# Altium project Dionysus LCD PMOD Rev B.PrjPCB
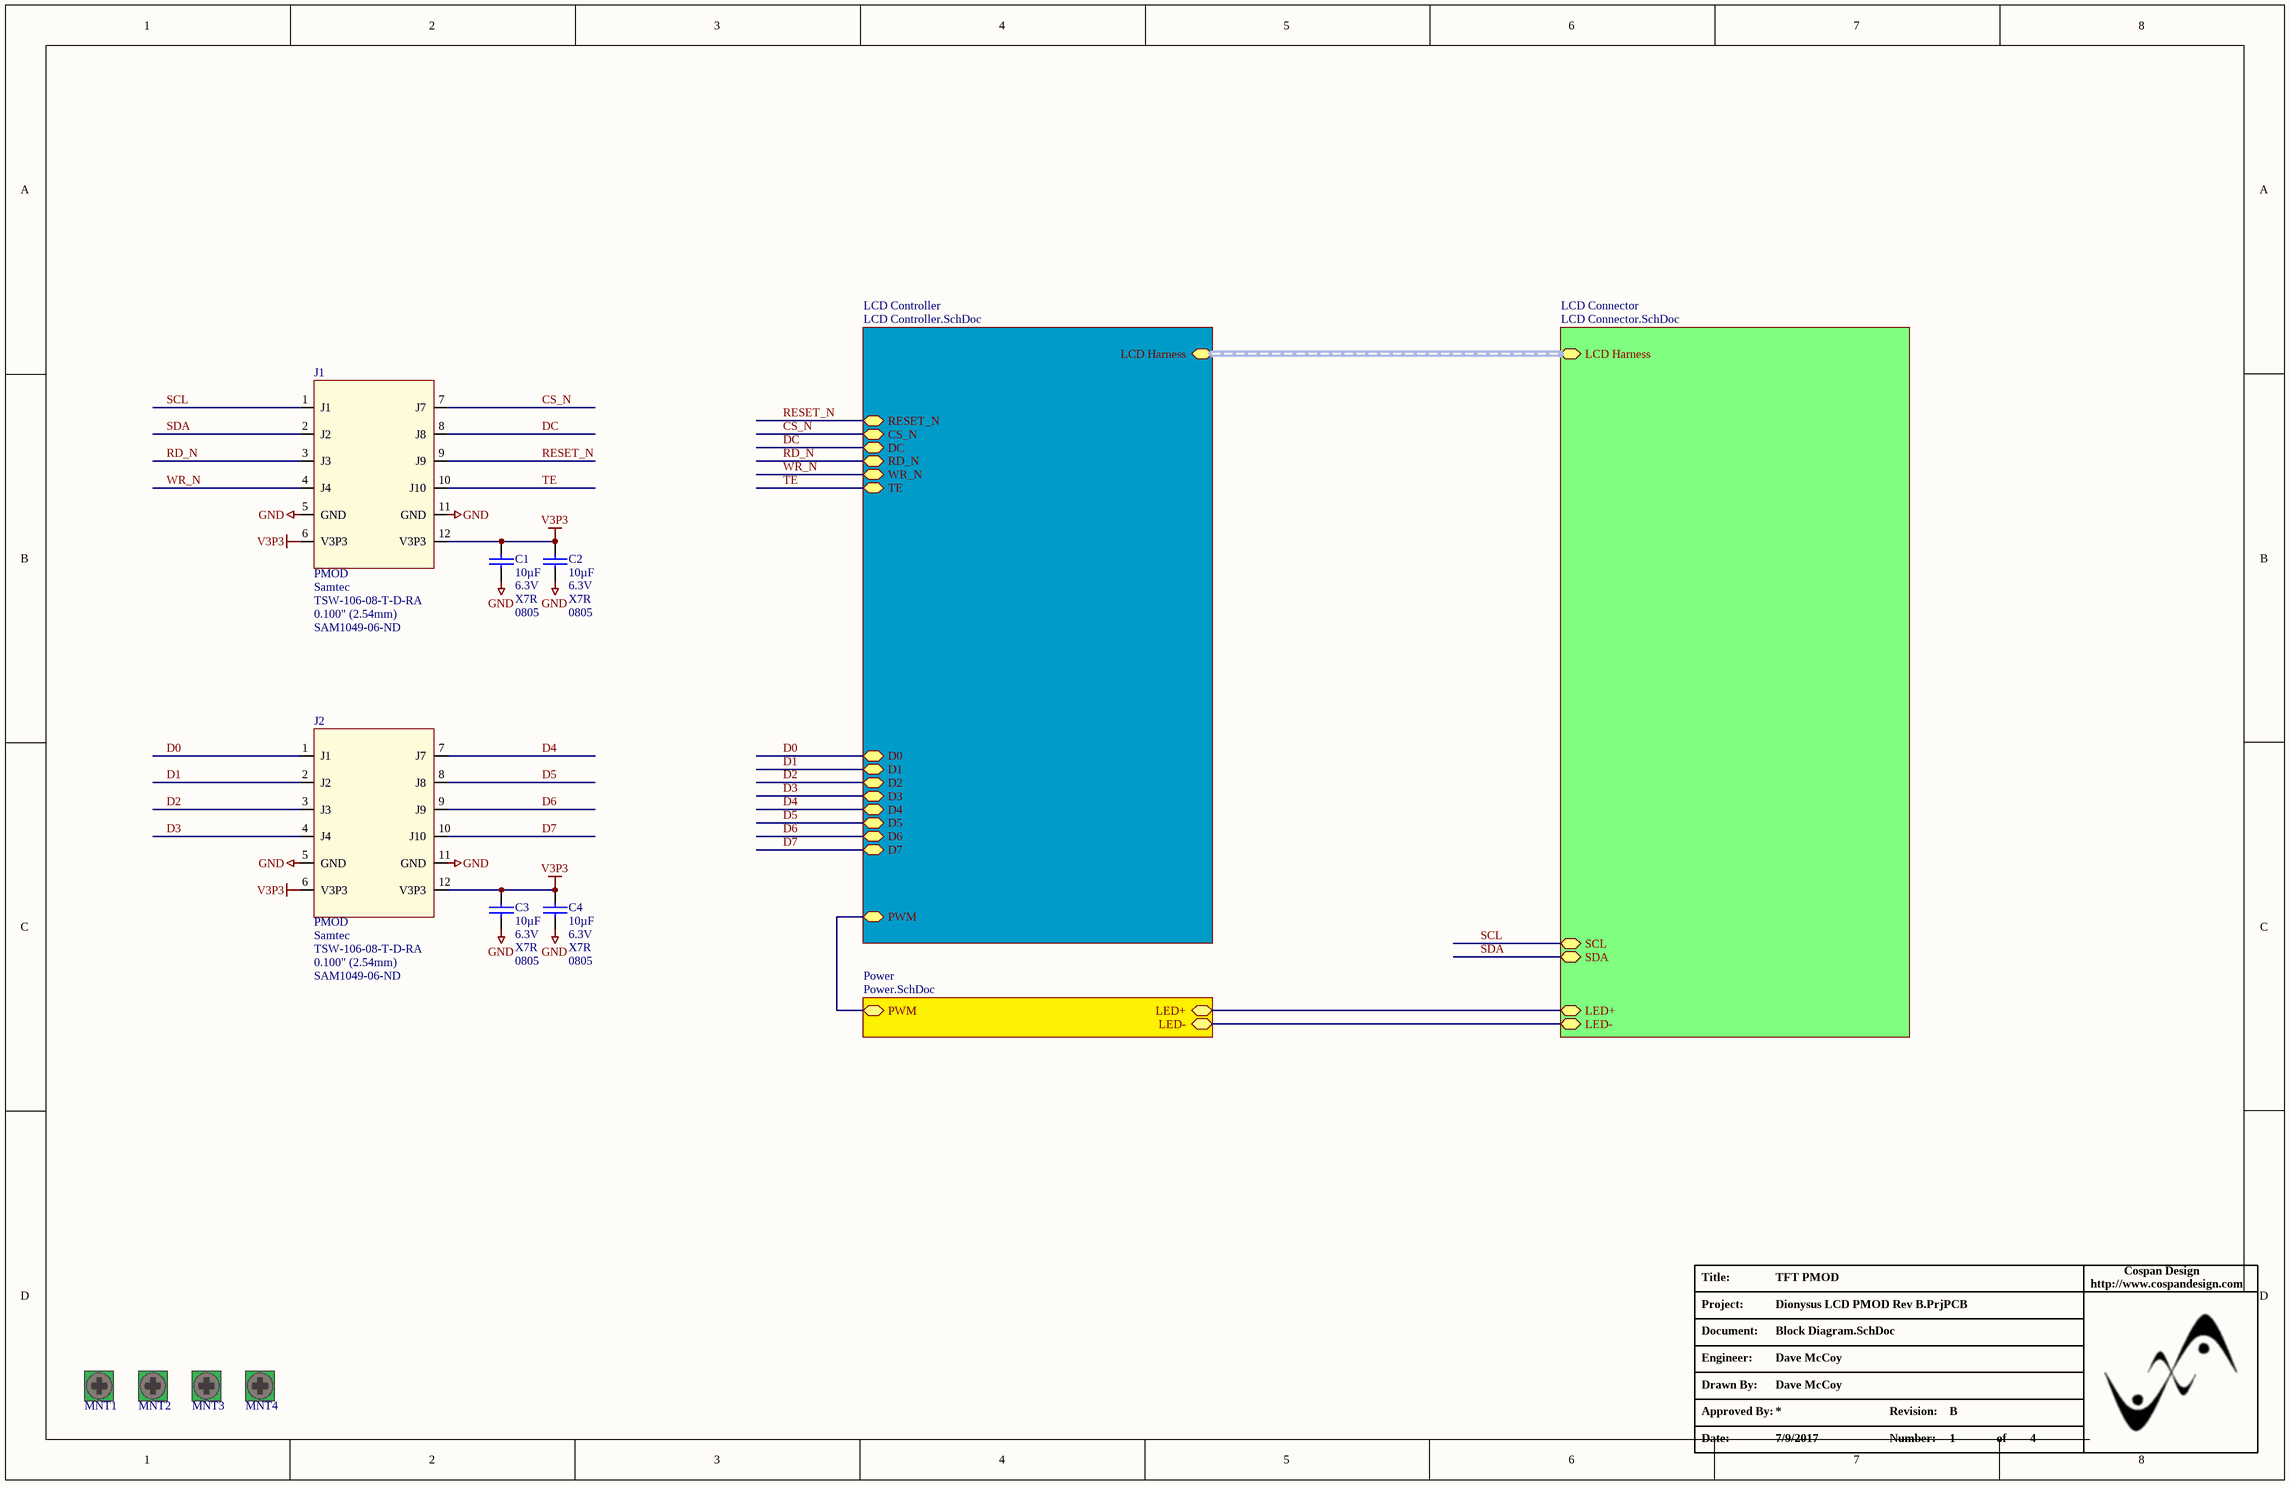
[diagram p0: Block Diagram.SchDoc]
Revision: B
4 sheets, 65 parts. Net scope: hierarchical (ports join the sheet entries above them; power ports are global).
Board file: Dionysus LCD PMOD.PcbDoc
Sheets:
  Block Diagram.SchDoc
    LCD Controller = LCD Controller.SchDoc
    LCD Connector = LCD Connector.SchDoc
    Power = Power.SchDoc

## Sheet Block Diagram.SchDoc: TFT PMOD
size Tabloid; Date: 7/9/2017; DrawnBy: Dave McCoy; Engineer: Dave McCoy; DocumentNumber: 1; Revision: B; SheetNumber: 1; SheetTotal: 4

### Parts
C1  Capacitance: 10µF  Voltage - Rated: 6.3V  Temperature Coefficient: X7R  Package / Case: 0805  [C_ERA-0805]  (hidden comment: 10uF)
C2  Capacitance: 10µF  Voltage - Rated: 6.3V  Temperature Coefficient: X7R  Package / Case: 0805  [C_ERA-0805]  (hidden comment: 10uF)
C3  Capacitance: 10µF  Voltage - Rated: 6.3V  Temperature Coefficient: X7R  Package / Case: 0805  [C_ERA-0805]  (hidden comment: 10uF)
C4  Capacitance: 10µF  Voltage - Rated: 6.3V  Temperature Coefficient: X7R  Package / Case: 0805  [C_ERA-0805]  (hidden comment: 10uF)
J1  PMOD  Manufacturer: Samtec  Manufacturer Part Number: TSW-106-08-T-D-RA  Pitch: 0.100" (2.54mm)  Supplier Part Number 1: SAM1049-06-ND  [PMOD PERIPHERAL]
J2  PMOD  Manufacturer: Samtec  Manufacturer Part Number: TSW-106-08-T-D-RA  Pitch: 0.100" (2.54mm)  Supplier Part Number 1: SAM1049-06-ND  [PMOD PERIPHERAL]
MNT1  Mounting Hole  [MNT_4-40]  (value not drawn)  (no BOM)
MNT2  Mounting Hole  [MNT_4-40]  (value not drawn)  (no BOM)
MNT3  Mounting Hole  [MNT_4-40]  (value not drawn)  (no BOM)
MNT4  Mounting Hole  [MNT_4-40]  (value not drawn)  (no BOM)

### Sub-sheets
LCD Connector = LCD Connector.SchDoc: LCD Harness (harness LCD Harness), LED+, LED-, SCL, SDA
LCD Controller = LCD Controller.SchDoc: PWM, LCD Harness (harness LCD Harness), RESET_N, CS_N, DC, RD_N, WR_N, TE, D0, D1, D2, D3, D4, D5, D6, D7
Power = Power.SchDoc: PWM, LED+, LED-

### Nets
GND: C1.1 C2.1 C3.1 C4.1 J1.5(GND) J1.11(GND) J2.5(GND) J2.11(GND)
V3P3: C1.2 C2.2 C3.2 C4.2 J1.6(V3P3) J1.12(V3P3) J2.6(V3P3) J2.12(V3P3)
CS_N: J1.7(J7) ; sheet LCD Controller/CS_N
D0: J2.1(J1) ; sheet LCD Controller/D0
D1: J2.2(J2) ; sheet LCD Controller/D1
D2: J2.3(J3) ; sheet LCD Controller/D2
D3: J2.4(J4) ; sheet LCD Controller/D3
D4: J2.7(J7) ; sheet LCD Controller/D4
D5: J2.8(J8) ; sheet LCD Controller/D5
D6: J2.9(J9) ; sheet LCD Controller/D6
D7: J2.10(J10) ; sheet LCD Controller/D7
DC: J1.8(J8) ; sheet LCD Controller/DC
LED+: sheet LCD Connector/LED+, sheet Power/LED+
LED-: sheet LCD Connector/LED-, sheet Power/LED-
PWM: sheet LCD Controller/PWM, sheet Power/PWM
RD_N: J1.3(J3) ; sheet LCD Controller/RD_N
RESET_N: J1.9(J9) ; sheet LCD Controller/RESET_N
SCL: J1.1(J1) ; sheet LCD Connector/SCL
SDA: J1.2(J2) ; sheet LCD Connector/SDA
TE: J1.10(J10) ; sheet LCD Controller/TE
WR_N: J1.4(J4) ; sheet LCD Controller/WR_N

### Buses and harness runs
harness sheet LCD Connector/LCD Harness = sheet LCD Controller/LCD Harness

### Notes on the sheet
- Title:
- http://www.cospandesign.com
- Cospan Design
- Project:
- Document:
- Engineer:
- Drawn By:
- Approved By:
- Revision:
- Date:
- Number:
- of

### Library data of the parts
C1-C4 = C_0805_10UF_6.3V: CAP CER 10UF 6.3V X7R 10% 0805; Manufacturer: Taiyo Yuden; Manufacturer Part Number: JMK212BJ106KD-T; Supplier 1: Digi-Key; RoHS: RoHS Compliant; Category: Capacitors; Stock 1: 94004; Pricing 1: 1=0.19, 10=0.132, 50=0.08, 100=0.0672, 250=0.0544, 500=0.048, 1000=0.0408 (USD); Tolerance: ±10%; Mounting Type: Surface Mount, MLCC; Operating Temperature: -55°C ~ 85°C; Applications: General Purpose; Ratings: -; Size / Dimension: 0.079" L x 0.049" W (2.00mm x 1.25mm); Height - Seated (Max): -; Thickness (Max): 0.037" (0.95mm); Lead Spacing: -; Features: -; Packaging: Cut Tape (CT); Lead Style: -; ComponentLink1URL: http://www.yuden.co.jp/productdata/catalog/en/mlcc01_e.pdf; ComponentLink1Description: http://www.yuden.co.jp/productdata/catalog/en/mlcc01_e.pdf; Supplier Part Number 1: 587-1304-1-ND; COST_1: *; COST_100: *; COST_1000: *; MANF1: *; MANF1_PN: *; MANF2: *; MANF2_PN: *; MANF3: *; MANF3_PN: *; VENDOR1: *; VENDOR1_PN: *
J1 J2 = J_PMOD_PERIPH: CONN HEADER 12PS .100 DL R/A TIN; Connector Type: Header, Unshrouded; Number of Positions: 12; Number of Positions Loaded: All; Supplier 1: Digi-Key; RoHS: RoHS Compliant; Category: Connectors, Interconnects; Stock 1: 0; Pricing 1: 1=1.4, 10=1.252, 100=1.0309, 500=0.81492, 1000=0.69955, 5000=0.63818, 10000=0.61364 (USD); Packaging: Bulk; Contact Type: Male Pin; Number of Rows: 2; Row Spacing: 0.100" (2.54mm); Contact Mating Length: 0.230" (5.84mm); Mounting Type: Through Hole, Right Angle; Termination: Solder; Fastening Type: -; Features: -; Contact Finish: Tin; Contact Finish Thickness: -; Color: Black; ComponentLink1URL: http://www.samtec.com/documents/webfiles/cpdf/TSW-XXX-XX-XXX-X-XX-XXX-MKT.pdf; ComponentLink1Description: http://www.samtec.com/documents/webfiles/cpdf/TSW-XXX-XX-XXX-X-XX-XXX-MKT.pdf
MNT1-MNT4 = MNT_440_HOLE

## Sheet LCD Controller.SchDoc: TFT PMOD
size Tabloid; Date: 7/9/2017; DrawnBy: Dave McCoy; Engineer: Dave McCoy; DocumentNumber: 2; Revision: B; SheetNumber: 2; SheetTotal: 4
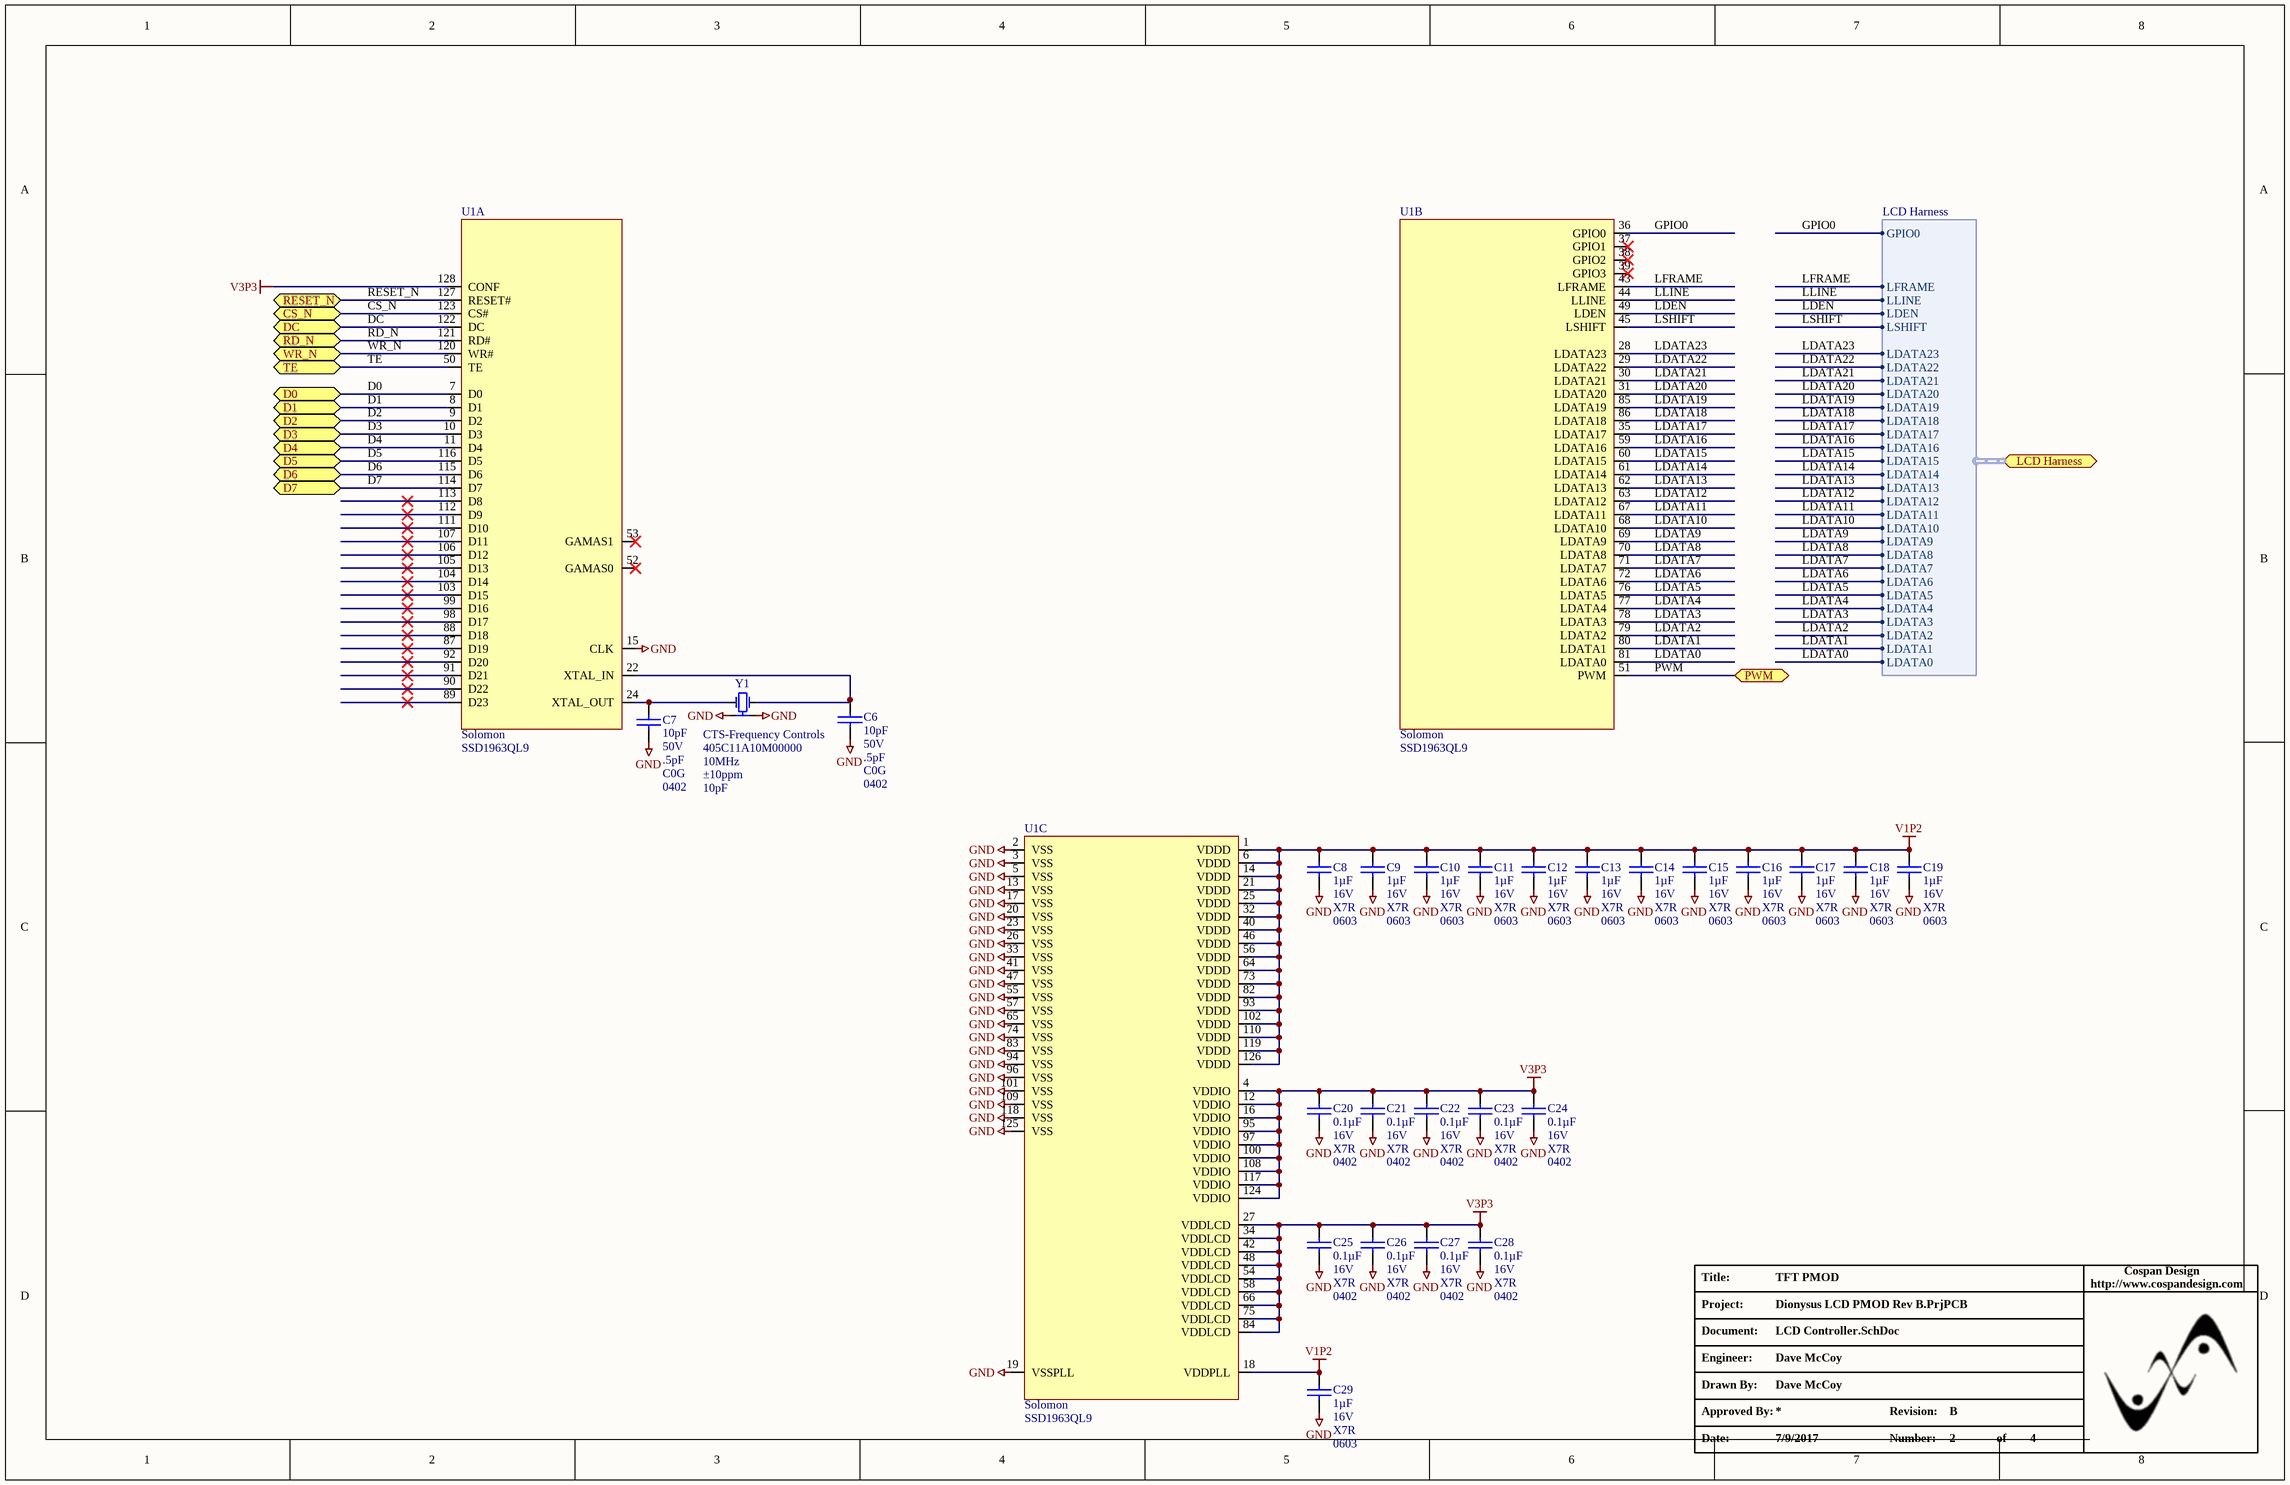
[diagram p1: LCD Controller.SchDoc]

### Parts
C6  Voltage - Rated: 50V  Tolerance: .5pF  Temperature Coefficient: C0G  Package / Case: 0402  [C_ERA-0402]  (hidden comment: 10pF)
C7  Voltage - Rated: 50V  Tolerance: .5pF  Temperature Coefficient: C0G  Package / Case: 0402  [C_ERA-0402]  (hidden comment: 10pF)
C8  Capacitance: 1µF  Voltage - Rated: 16V  Temperature Coefficient: X7R  Package / Case: 0603  [C_ERA-0603]  (hidden comment: C_0603_1µF_16V)
C9  Capacitance: 1µF  Voltage - Rated: 16V  Temperature Coefficient: X7R  Package / Case: 0603  [C_ERA-0603]  (hidden comment: C_0603_1µF_16V)
C10  Capacitance: 1µF  Voltage - Rated: 16V  Temperature Coefficient: X7R  Package / Case: 0603  [C_ERA-0603]  (hidden comment: C_0603_1µF_16V)
C11  Capacitance: 1µF  Voltage - Rated: 16V  Temperature Coefficient: X7R  Package / Case: 0603  [C_ERA-0603]  (hidden comment: C_0603_1µF_16V)
C12  Capacitance: 1µF  Voltage - Rated: 16V  Temperature Coefficient: X7R  Package / Case: 0603  [C_ERA-0603]  (hidden comment: C_0603_1µF_16V)
C13  Capacitance: 1µF  Voltage - Rated: 16V  Temperature Coefficient: X7R  Package / Case: 0603  [C_ERA-0603]  (hidden comment: C_0603_1µF_16V)
C14  Capacitance: 1µF  Voltage - Rated: 16V  Temperature Coefficient: X7R  Package / Case: 0603  [C_ERA-0603]  (hidden comment: C_0603_1µF_16V)
C15  Capacitance: 1µF  Voltage - Rated: 16V  Temperature Coefficient: X7R  Package / Case: 0603  [C_ERA-0603]  (hidden comment: C_0603_1µF_16V)
C16  Capacitance: 1µF  Voltage - Rated: 16V  Temperature Coefficient: X7R  Package / Case: 0603  [C_ERA-0603]  (hidden comment: C_0603_1µF_16V)
C17  Capacitance: 1µF  Voltage - Rated: 16V  Temperature Coefficient: X7R  Package / Case: 0603  [C_ERA-0603]  (hidden comment: C_0603_1µF_16V)
C18  Capacitance: 1µF  Voltage - Rated: 16V  Temperature Coefficient: X7R  Package / Case: 0603  [C_ERA-0603]  (hidden comment: C_0603_1µF_16V)
C19  Capacitance: 1µF  Voltage - Rated: 16V  Temperature Coefficient: X7R  Package / Case: 0603  [C_ERA-0603]  (hidden comment: C_0603_1µF_16V)
C20  Capacitance: 0.1µF  Voltage - Rated: 16V  Temperature Coefficient: X7R  Package / Case: 0402  [C_0402]  (hidden comment: 0.1uF)
C21  Capacitance: 0.1µF  Voltage - Rated: 16V  Temperature Coefficient: X7R  Package / Case: 0402  [C_0402]  (hidden comment: 0.1uF)
C22  Capacitance: 0.1µF  Voltage - Rated: 16V  Temperature Coefficient: X7R  Package / Case: 0402  [C_0402]  (hidden comment: 0.1uF)
C23  Capacitance: 0.1µF  Voltage - Rated: 16V  Temperature Coefficient: X7R  Package / Case: 0402  [C_0402]  (hidden comment: 0.1uF)
C24  Capacitance: 0.1µF  Voltage - Rated: 16V  Temperature Coefficient: X7R  Package / Case: 0402  [C_0402]  (hidden comment: 0.1uF)
C25  Capacitance: 0.1µF  Voltage - Rated: 16V  Temperature Coefficient: X7R  Package / Case: 0402  [C_0402]  (hidden comment: 0.1uF)
C26  Capacitance: 0.1µF  Voltage - Rated: 16V  Temperature Coefficient: X7R  Package / Case: 0402  [C_0402]  (hidden comment: 0.1uF)
C27  Capacitance: 0.1µF  Voltage - Rated: 16V  Temperature Coefficient: X7R  Package / Case: 0402  [C_0402]  (hidden comment: 0.1uF)
C28  Capacitance: 0.1µF  Voltage - Rated: 16V  Temperature Coefficient: X7R  Package / Case: 0402  [C_0402]  (hidden comment: 0.1uF)
C29  Capacitance: 1µF  Voltage - Rated: 16V  Temperature Coefficient: X7R  Package / Case: 0603  [C_ERA-0603]  (hidden comment: C_0603_1µF_16V)
U1  Manufacturer: Solomon  [LQFP128]  (hidden comment: U_SSD1963QL9)  (parts A,B,C of 3)
Y1  Manufacturer: CTS-Frequency Controls  Manufacturer Part Number: 405C11A10M00000  Frequency: 10MHz  Frequency Stability: ±10ppm  Load Capacitance: 10pF  [SMD_OSC_8MHZ]  (hidden comment: Y_SMD_10.00MHZ_10PF)

### Ports
CS_N, D0, D1, D2, D3, D4, D5, D6, D7, DC, LCD Harness (harness LCD Harness), PWM, RD_N, RESET_N, TE, WR_N

### Harnesses
LCD Harness: GPIO0, LFRAME, LLINE, LDEN, LSHIFT, LDATA0, LDATA1, LDATA2, LDATA3, LDATA4, LDATA5, LDATA6, LDATA7, LDATA8, LDATA9, LDATA10, LDATA11, LDATA12, LDATA13, LDATA14, LDATA15, LDATA16, LDATA17, LDATA18, LDATA19, LDATA20, LDATA21, LDATA22, LDATA23

### Nets
GND: C6.1 C7.1 C8.1 C9.1 C10.1 C11.1 C12.1 C13.1 C14.1 C15.1 C16.1 C17.1 C18.1 C19.1 C20.1 C21.1 C22.1 C23.1 C24.1 C25.1 C26.1 C27.1 C28.1 C29.1 U1.2(VSS) U1.3(VSS) U1.5(VSS) U1.13(VSS) U1.15(CLK) U1.17(VSS) U1.19(VSSPLL) U1.20(VSS) U1.23(VSS) U1.26(VSS) U1.33(VSS) U1.41(VSS) U1.47(VSS) U1.55(VSS) U1.57(VSS) U1.65(VSS) U1.74(VSS) U1.83(VSS) U1.94(VSS) U1.96(VSS) U1.101(VSS) U1.109(VSS) U1.118(VSS) U1.125(VSS) Y1.2 Y1.4
V1P2: C8.2 C9.2 C10.2 C11.2 C12.2 C13.2 C14.2 C15.2 C16.2 C17.2 C18.2 C19.2 C29.2 U1.1(VDDD) U1.6(VDDD) U1.14(VDDD) U1.18(VDDPLL) U1.21(VDDD) U1.25(VDDD) U1.32(VDDD) U1.40(VDDD) U1.46(VDDD) U1.56(VDDD) U1.64(VDDD) U1.73(VDDD) U1.82(VDDD) U1.93(VDDD) U1.102(VDDD) U1.110(VDDD) U1.119(VDDD) U1.126(VDDD)
V3P3: C20.2 C21.2 C22.2 C23.2 C24.2 C25.2 C26.2 C27.2 C28.2 U1.4(VDDIO) U1.12(VDDIO) U1.16(VDDIO) U1.27(VDDLCD) U1.34(VDDLCD) U1.42(VDDLCD) U1.48(VDDLCD) U1.54(VDDLCD) U1.58(VDDLCD) U1.66(VDDLCD) U1.75(VDDLCD) U1.84(VDDLCD) U1.95(VDDIO) U1.97(VDDIO) U1.100(VDDIO) U1.108(VDDIO) U1.117(VDDIO) U1.124(VDDIO) U1.128(CONF)
CS_N: U1.123(CS#) ; port CS_N
D0: U1.7(D0) ; port D0
D1: U1.8(D1) ; port D1
D2: U1.9(D2) ; port D2
D3: U1.10(D3) ; port D3
D4: U1.11(D4) ; port D4
D5: U1.116(D5) ; port D5
D6: U1.115(D6) ; port D6
D7: U1.114(D7) ; port D7
DC: U1.122(DC) ; port DC
GPIO0: U1.36(GPIO0) ; port LCD Harness.GPIO0
LDATA0: U1.81(LDATA0) ; port LCD Harness.LDATA0
LDATA1: U1.80(LDATA1) ; port LCD Harness.LDATA1
LDATA2: U1.79(LDATA2) ; port LCD Harness.LDATA2
LDATA3: U1.78(LDATA3) ; port LCD Harness.LDATA3
LDATA4: U1.77(LDATA4) ; port LCD Harness.LDATA4
LDATA5: U1.76(LDATA5) ; port LCD Harness.LDATA5
LDATA6: U1.72(LDATA6) ; port LCD Harness.LDATA6
LDATA7: U1.71(LDATA7) ; port LCD Harness.LDATA7
LDATA8: U1.70(LDATA8) ; port LCD Harness.LDATA8
LDATA9: U1.69(LDATA9) ; port LCD Harness.LDATA9
LDATA10: U1.68(LDATA10) ; port LCD Harness.LDATA10
LDATA11: U1.67(LDATA11) ; port LCD Harness.LDATA11
LDATA12: U1.63(LDATA12) ; port LCD Harness.LDATA12
LDATA13: U1.62(LDATA13) ; port LCD Harness.LDATA13
LDATA14: U1.61(LDATA14) ; port LCD Harness.LDATA14
LDATA15: U1.60(LDATA15) ; port LCD Harness.LDATA15
LDATA16: U1.59(LDATA16) ; port LCD Harness.LDATA16
LDATA17: U1.35(LDATA17) ; port LCD Harness.LDATA17
LDATA18: U1.86(LDATA18) ; port LCD Harness.LDATA18
LDATA19: U1.85(LDATA19) ; port LCD Harness.LDATA19
LDATA20: U1.31(LDATA20) ; port LCD Harness.LDATA20
LDATA21: U1.30(LDATA21) ; port LCD Harness.LDATA21
LDATA22: U1.29(LDATA22) ; port LCD Harness.LDATA22
LDATA23: U1.28(LDATA23) ; port LCD Harness.LDATA23
LDEN: U1.49(LDEN) ; port LCD Harness.LDEN
LFRAME: U1.43(LFRAME) ; port LCD Harness.LFRAME
LLINE: U1.44(LLINE) ; port LCD Harness.LLINE
LSHIFT: U1.45(LSHIFT) ; port LCD Harness.LSHIFT
PWM: U1.51(PWM) ; port PWM
RD_N: U1.121(RD#) ; port RD_N
RESET_N: U1.127(RESET#) ; port RESET_N
TE: U1.50(TE) ; port TE
WR_N: U1.120(WR#) ; port WR_N
NetC6_2: C6.2 U1.22(XTAL_IN) Y1.3
NetC7_2: C7.2 U1.24(XTAL_OUT) Y1.1

Not connected (* = marked no-connect by the designer): U1 37(GPIO1)* 38(GPIO2)* 39(GPIO3)* 52(GAMAS0)* 53(GAMAS1)* 87(D19)* 88(D18)* 89(D23)* 90(D22)* 91(D21)* 92(D20)* 98(D17)* 99(D16)* 103(D15)* 104(D14)* 105(D13)* 106(D12)* 107(D11)* 111(D10)* 112(D9)* 113(D8)*

### Notes on the sheet
- Title:
- http://www.cospandesign.com
- Cospan Design
- Project:
- Document:
- Engineer:
- Drawn By:
- Approved By:
- Revision:
- Date:
- Number:
- of

### Library data of the parts
C6 C7 = C_0402_10PF_50V: CAP CER 10PF 50V NP0 0402; Manufacturer: Taiyo Yuden; Manufacturer Part Number: UMK105CG100DV-F; Supplier 1: Digi-Key; Supplier Part Number 1: 587-1947-1-ND; RoHS: RoHS Compliant; Category: Capacitors; Stock 1: 47289; Pricing: 1=0.07, 10=0.045, 50=0.0216, 100=0.0162, 250=0.01172, 500=0.00864, 1000=0.00585, 5000=0.0045 (USD); Mounting Type: Surface Mount, MLCC; Operating Temperature: -55°C ~ 125°C; Applications: General Purpose; Ratings: -; Size / Dimension: 0.039" L x 0.020" W (1.00mm x 0.50mm); Height - Seated (Max): -; Thickness (Max): 0.022" (0.55mm); Lead Spacing: -; Features: -; Packaging: Cut Tape (CT); Lead Style: -; ComponentLink1URL: http://www.yuden.co.jp/productdata/catalog/en/mlcc02_e.pdf; ComponentLink1Description: http://www.yuden.co.jp/productdata/catalog/en/mlcc02_e.pdf; Capacitance: 10pF; COST_1: *; COST_100: *; COST_1000: *; MANF1: *; MANF1_PN: *; MANF2: *; MANF2_PN: *; MANF3: *; MANF3_PN: *; VENDOR1: *; VENDOR1_PN: *
C8-C19 C29 = C_0603_1µF_16V: CAP CER 1UF 16V X7R 0603; Manufacturer: Yageo; Manufacturer Part Number: CC0603KRX7R7BB105; Tolerance: 10%; Dissipation Factor: 5%; Supplier 1: Digikey; Stock 1: 531531; Pricing 1: 1=0.1, 10=0.053, 100=0.0237, 500=0.0169, 1000=0.0133 (USD); Mount: Surface Mount; Case/Package: 0603; Number of Pins: 2; Case Code (Metric): 1608; Case Code (Imperial): 0603; Min Operating Temperature: -55°C; Max Operating Temperature: 125°C; Voltage Rating: 16V; Package Quantity: 1; Packaging: Tape and Reel; Voltage Rating (DC): 16V; Dielectric: X7R; Termination: SMD/SMT; Composition: Ceramic; Length: 1.6mm; Height: 0.8mm; Width: 0.031inch; Thickness: 0.035inch; Depth: 0.8mm; Radiation Hardening: No; REACH SVHC: Unknown; Lead Free: Lead Free; Halogen Free: Halogen Free; ComponentLink1URL: https://datasheet.ciiva.com/176/mlccorderingcode-176788.pdf; ComponentLink1Description: https://datasheet.ciiva.com/176/mlccorderingcode-176788.pdf; ComponentLink2URL: https://datasheet.ciiva.com/176/mlccorderingcode-176789.pdf; ComponentLink2Description: https://datasheet.ciiva.com/176/mlccorderingcode-176789.pdf; ComponentLink3URL: https://datasheet.ciiva.com/176/mlccorderingcode-176790.pdf; ComponentLink3Description: https://datasheet.ciiva.com/176/mlccorderingcode-176790.pdf; ComponentLink4URL: https://datasheet.ciiva.com/5425/upy-gphc-x7r-6-3v-to-50v-8-12304-5425495.pdf; ComponentLink4Description: https://datasheet.ciiva.com/5425/upy-gphc-x7r-6-3v-to-50v-8-12304-5425495.pdf; ComponentLink5URL: https://datasheet.ciiva.com/16625/upy-gphc-x7r-6-3v-to-50v-8-16625527.pdf; ComponentLink5Description: https://datasheet.ciiva.com/16625/upy-gphc-x7r-6-3v-to-50v-8-16625527.pdf; ComponentLink6URL: https://datasheet.ciiva.com/8033/1734573-8033800.pdf; ComponentLink6Description: https://datasheet.ciiva.com/8033/1734573-8033800.pdf; ComponentLink7URL: https://datasheet.ciiva.com/8033/1734573-8033801.pdf; ComponentLink7Description: https://datasheet.ciiva.com/8033/1734573-8033801.pdf; ComponentLink8URL: https://datasheet.ciiva.com/28450/1489800-28450557.pdf; ComponentLink8Description: https://datasheet.ciiva.com/28450/1489800-28450557.pdf; ComponentLink9URL: https://datasheet.ciiva.com/7978/1489800-7978143.pdf; ComponentLink9Description: https://datasheet.ciiva.com/7978/1489800-7978143.pdf; Supplier Part Number 1: 311-1446-6-ND
C20-C28 = C_0402_0.1UF_16V: CAP CER .10UF 16V X7R 0402; Manufacturer: TDK Corporation; Manufacturer Part Number: C1005X7R1C104K050BC; Tolerance: ±10%; Supplier 1: Digi-Key; Supplier Part Number 1: 445-4952-1-ND; RoHS: RoHS Compliant; Category: Capacitors; Stock 1: 2696686; Mounting Type: Surface Mount, MLCC; Features: Low ESL; Lead Spacing: -; Packaging: Cut Tape (CT); ComponentLink1URL: https://product.tdk.com/info/en/catalog/datasheets/mlcc_commercial_general_en.pdf; ComponentLink1Description: https://product.tdk.com/info/en/catalog/datasheets/mlcc_commercial_general_en.pdf; Operating Temperature: -55°C ~ 125°C; Pricing 1: 1=0.1, 10=0.05, 100=0.0231, 250=0.01892, 500=0.01618, 1000=0.0126, 5000=0.0105 (USD); Part Status: Not For New Designs; Ratings: -; Applications: General Purpose; Failure Rate: -; Size / Dimension: 0.039" L x 0.020" W (1.00mm x 0.50mm); Height - Seated (Max): -; Thickness (Max): 0.022" (0.55mm); Lead Style: -
U1 = U_SSD1963QL9: SSD1963QL9; Manufacturer Part Number: SSD1963QL9
Y1 = Y_SMD_10.00MHZ_10PF: CRYSTAL 10MHZ 10PF SMD; ESR (Equivalent Series Resistance): 60 Ohm; Operating Mode: Fundamental; Supplier 1: Digi-Key; Supplier Part Number 1: CTX832CT-ND; RoHS: RoHS Compliant; Category: Crystals and Oscillators; Stock 1: 2457; Pricing: 1=1.23, 10=1.089, 50=1.017, 100=0.9, 500=0.8505 (USD); Packaging: Cut Tape (CT); Type: MHz Crystal; Frequency Tolerance: ±10ppm; Operating Temperature: -20°C ~ 70°C; Ratings: -; Mounting Type: Surface Mount; Package / Case: 4-SMD, No Lead (DFN, LCC); Size / Dimension: 0.197" L x 0.126" W (5.00mm x 3.20mm); Height: 0.041" (1.05mm); ComponentLink1URL: http://www.ctscorp.com/components/Datasheets/008-0253-0.pdf; ComponentLink1Description: http://www.ctscorp.com/components/Datasheets/008-0253-0.pdf

## Sheet LCD Connector.SchDoc: TFT PMOD
size Tabloid; Date: 7/9/2017; DrawnBy: Dave McCoy; Engineer: Dave McCoy; DocumentNumber: 3; Revision: B; SheetNumber: 3; SheetTotal: 4
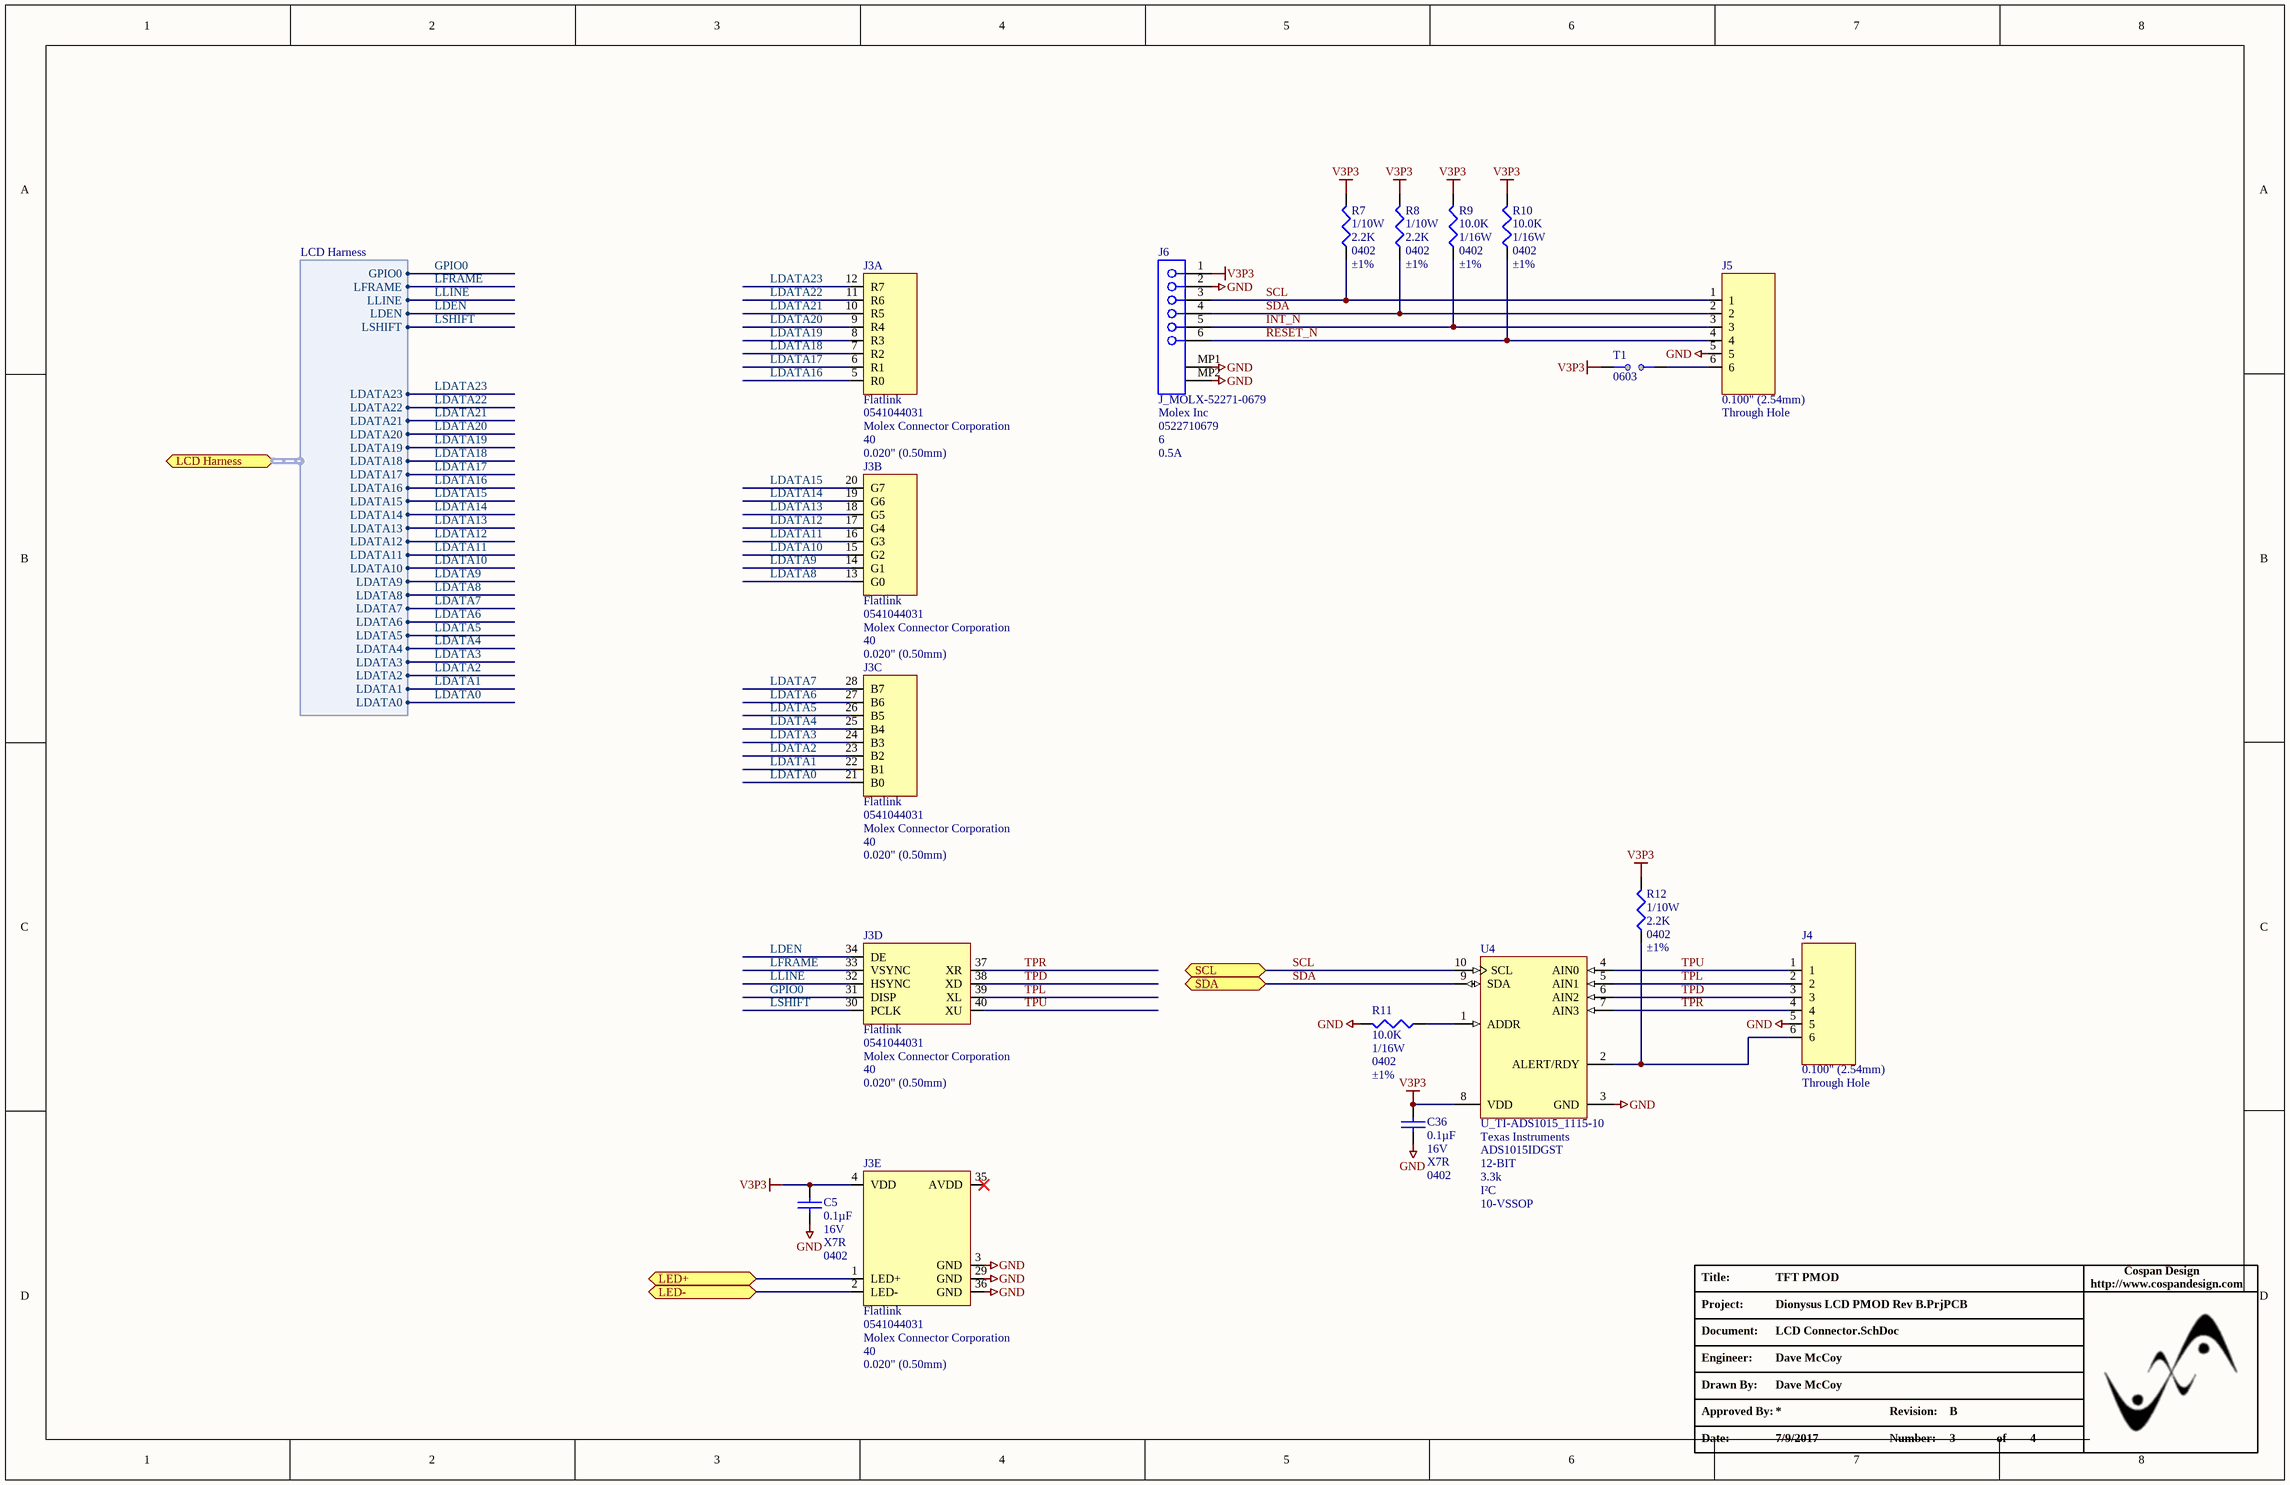
[diagram p2: LCD Connector.SchDoc]

### Parts
C5  Capacitance: 0.1µF  Voltage - Rated: 16V  Temperature Coefficient: X7R  Package / Case: 0402  [C_0402]  (hidden comment: 0.1uF)
C36  Capacitance: 0.1µF  Voltage - Rated: 16V  Temperature Coefficient: X7R  Package / Case: 0402  [C_0402]  (hidden comment: 0.1uF)
J3  Flatlink  Manufacturer Part Number: 0541044031  Manufacturer: Molex Connector Corporation  Number of Positions: 40  Pitch: 0.020" (0.50mm)  [FPC_40PIN]  (parts A,B,C,D,E of 5)
J4  Pitch: 0.100" (2.54mm)  Mounting Type: Through Hole  [HDR_1X6 - FEMALE]  (hidden comment: J_HDR1X6_THRHOLE_VERT_FEMALE)
J5  Pitch: 0.100" (2.54mm)  Mounting Type: Through Hole  [HDR_1X6]  (hidden comment: J_HDR1X6_THRHOLE_VERT)
J6  J_MOLX-52271-0679  Manufacturer: Molex Inc  Manufacturer Part Number: 0522710679  Number of Positions: 6  Current Rating: 0.5A  [MOLX-52271-0679]
R7  Power (Watts): 1/10W  Resistance In Ohms: 2.2K  Case: 0402  Tolerance: ±1%  [R_0402]  (hidden comment: 2.2k Ohms)
R8  Power (Watts): 1/10W  Resistance In Ohms: 2.2K  Case: 0402  Tolerance: ±1%  [R_0402]  (hidden comment: 2.2k Ohms)
R9  Resistance In Ohms: 10.0K  Power (Watts): 1/16W  Case: 0402  Tolerance: ±1%  [R_0402]  (hidden comment: R_0402_10.0K)
R10  Resistance In Ohms: 10.0K  Power (Watts): 1/16W  Case: 0402  Tolerance: ±1%  [R_0402]  (hidden comment: R_0402_10.0K)
R11  Resistance In Ohms: 10.0K  Power (Watts): 1/16W  Case: 0402  Tolerance: ±1%  [R_0402]  (hidden comment: R_0402_10.0K)
R12  Power (Watts): 1/10W  Resistance In Ohms: 2.2K  Case: 0402  Tolerance: ±1%  [R_0402]  (hidden comment: 2.2k Ohms)
T1  Case: 0603  [ERA-0603-SOLDER_JUMPER]  (hidden comment: Place Solder Bridge to Enable)  (no BOM)
U4  U_TI-ADS1015_1115-10  Manufacturer: Texas Instruments  Manufacturer Part Number: ADS1015IDGST  Number of Bits: 12-BIT  Sampling Rate (Per Second): 3.3k  Data Interface: I²C  Supplier Device Package: 10-VSSOP  [TI-DGS10_L]

### Ports
LCD Harness (harness LCD Harness), LED+, LED-, SCL, SDA

### Harnesses
LCD Harness: GPIO0, LFRAME, LLINE, LDEN, LSHIFT, LDATA0, LDATA1, LDATA2, LDATA3, LDATA4, LDATA5, LDATA6, LDATA7, LDATA8, LDATA9, LDATA10, LDATA11, LDATA12, LDATA13, LDATA14, LDATA15, LDATA16, LDATA17, LDATA18, LDATA19, LDATA20, LDATA21, LDATA22, LDATA23

### Nets
GND: C5.1 C36.1 J3.3(GND) J3.29(GND) J3.36(GND) J4.5 J5.5 J6.2 J6.MP1 J6.MP2 R11.1 U4.3(GND)
V3P3: C5.2 C36.2 J3.4(VDD) J6.1 R7.1 R8.1 R9.1 R10.1 R12.1 T1.1 U4.8(VDD)
GPIO0: J3.31(DISP) ; port LCD Harness.GPIO0
INT_N: J5.3 J6.5 R9.2
LDATA0: J3.21(B0) ; port LCD Harness.LDATA0
LDATA1: J3.22(B1) ; port LCD Harness.LDATA1
LDATA2: J3.23(B2) ; port LCD Harness.LDATA2
LDATA3: J3.24(B3) ; port LCD Harness.LDATA3
LDATA4: J3.25(B4) ; port LCD Harness.LDATA4
LDATA5: J3.26(B5) ; port LCD Harness.LDATA5
LDATA6: J3.27(B6) ; port LCD Harness.LDATA6
LDATA7: J3.28(B7) ; port LCD Harness.LDATA7
LDATA8: J3.13(G0) ; port LCD Harness.LDATA8
LDATA9: J3.14(G1) ; port LCD Harness.LDATA9
LDATA10: J3.15(G2) ; port LCD Harness.LDATA10
LDATA11: J3.16(G3) ; port LCD Harness.LDATA11
LDATA12: J3.17(G4) ; port LCD Harness.LDATA12
LDATA13: J3.18(G5) ; port LCD Harness.LDATA13
LDATA14: J3.19(G6) ; port LCD Harness.LDATA14
LDATA15: J3.20(G7) ; port LCD Harness.LDATA15
LDATA16: J3.5(R0) ; port LCD Harness.LDATA16
LDATA17: J3.6(R1) ; port LCD Harness.LDATA17
LDATA18: J3.7(R2) ; port LCD Harness.LDATA18
LDATA19: J3.8(R3) ; port LCD Harness.LDATA19
LDATA20: J3.9(R4) ; port LCD Harness.LDATA20
LDATA21: J3.10(R5) ; port LCD Harness.LDATA21
LDATA22: J3.11(R6) ; port LCD Harness.LDATA22
LDATA23: J3.12(R7) ; port LCD Harness.LDATA23
LDEN: J3.34(DE) ; port LCD Harness.LDEN
LED+: J3.1(LED+) ; port LED+
LED-: J3.2(LED-) ; port LED-
LFRAME: J3.33(VSYNC) ; port LCD Harness.LFRAME
LLINE: J3.32(HSYNC) ; port LCD Harness.LLINE
LSHIFT: J3.30(PCLK) ; port LCD Harness.LSHIFT
RESET_N: J5.4 J6.6 R10.2
SCL: J5.1 J6.3 R7.2 U4.10(SCL) ; port SCL
SDA: J5.2 J6.4 R8.2 U4.9(SDA) ; port SDA
TPD: J3.38(XD) J4.3 U4.6(AIN2)
TPL: J3.39(XL) J4.2 U4.5(AIN1)
TPR: J3.37(XR) J4.4 U4.7(AIN3)
TPU: J3.40(XU) J4.1 U4.4(AIN0)
NetJ4_6: J4.6 R12.2 U4.2(ALERT/RDY)
NetJ5_6: J5.6 T1.2
NetR11_2: R11.2 U4.1(ADDR)

Not connected (* = marked no-connect by the designer): J3 35(AVDD)*

### Notes on the sheet
- Title:
- http://www.cospandesign.com
- Cospan Design
- Project:
- Document:
- Engineer:
- Drawn By:
- Approved By:
- Revision:
- Date:
- Number:
- of

### Library data of the parts
C5 C36 = C_0402_0.1UF_16V: as C20 on sheet LCD Controller; Supplier 1: Digi-Key; Supplier Part Number 1: 445-4952-1-ND; RoHS: RoHS Compliant; Category: Capacitors; Stock 1: 2696686; Mounting Type: Surface Mount, MLCC; Features: Low ESL; Lead Spacing: -; Packaging: Cut Tape (CT); ComponentLink1URL: https://product.tdk.com/info/en/catalog/datasheets/mlcc_commercial_general_en.pdf; ComponentLink1Description: https://product.tdk.com/info/en/catalog/datasheets/mlcc_commercial_general_en.pdf; Operating Temperature: -55°C ~ 125°C; Pricing 1: 1=0.1, 10=0.05, 100=0.0231, 250=0.01892, 500=0.01618, 1000=0.0126, 5000=0.0105 (USD); Part Status: Not For New Designs; Ratings: -; Applications: General Purpose; Failure Rate: -; Size / Dimension: 0.039" L x 0.020" W (1.00mm x 0.50mm); Height - Seated (Max): -; Thickness (Max): 0.022" (0.55mm); Lead Style: -
J3 = J_FPC_MOLEX_40POS_TOP: CONN FFC/FPC .50MM 40POS R/A SMD; Flat Flex Type: FFC, FPC; Connector/Contact Type: Contacts, Top; FFC, FCB Thickness: 0.30mm; Locking Feature: Slide Lock; Cable End Type: Straight, Tapered; Actuator Material: Polyphenylene Sulfide (PPS), Glass Filled; Voltage Rating: 50V; Material Flammability Rating: UL94 V-0; Current Rating: 0.5A; Supplier 1: Digi-Key; Supplier Part Number 1: WM3431CT-ND; RoHS: RoHS Compliant; Category: Connectors, Interconnects; Stock 1: 5388; Pricing: 1=2.8, 10=2.686, 25=2.4624, 50=2.3506, 100=2.2387, 250=1.95888, 500=1.90292 (USD); Packaging: Cut Tape (CT); Mounting Type: Surface Mount, Right Angle; Termination: Solder; Height Above Board: 0.079" (2.00mm); Contact Material: Phosphor Bronze; Contact Finish: Gold; Housing Material: Polyamide (PA46), Nylon 4/6, Glass Filled; Features: Solder Retention, Zero Insertion Force (ZIF); Operating Temperature: -20°C ~ 85°C; ComponentLink1URL: http://www.molex.com/pdm_docs/sd/541044031_sd.pdf; ComponentLink1Description: http://www.molex.com/pdm_docs/sd/541044031_sd.pdf
J4 = J_HDR1X6_THRHOLE_VERT_FEMALE: CONN HEADER FEMALE 6POS .1" TIN; Manufacturer: Samtec; Manufacturer Part Number: SSW-106-01-T-S; Number of Positions: 6; Number of Positions Loaded: All; Supplier 1: Samtec; Supplier Part Number 1: SSW-106-01-T-S; Category: Connectors, Interconnects; Connector Type: Header; Contact Type: Female Socket; Number of Rows: 1; Termination: Solder; Contact Finish: Tin; Contact Finish Thickness: -; Color: Black; ComponentLink1URL: http://www.sullinscorp.com/drawings/101_xPxCxxxLFBN-RC,_10492-D.pdf; ComponentLink1Description: http://www.sullinscorp.com/drawings/101_xPxCxxxLFBN-RC,_10492-D.pdf; Pricing: 0.373; COST_1: *; COST_100: *; COST_1000: *; MANF1: *; MANF1_PN: *; MANF2: *; MANF2_PN: *; MANF3: *; MANF3_PN: *; VENDOR1: *; VENDOR1_PN: *
J5 = J_HDR1X6_THRHOLE_VERT: CONN HEADER .100" 12POS TIN PCB; Manufacturer: Samtec; Manufacturer Part Number: TSW-106-07-T-S; Connector Type: Unshrouded; Number of Positions: 6; Number of Positions Loaded: All; Supplier 1: Samtec; Supplier Part Number 1: TSW-106-07-T-S; RoHS: RoHS Compliant; Category: Connectors, Interconnects; Stock 1: 0; Number of Rows: 1; Row Spacing: -; Height Stacking (Mating): -; Height Above Board: 0.100" (2.54mm); Contact Mating Length: 0.166" (4.22mm); Termination: Solder; Contact Finish: Tin; Contact Finish Thickness: 200µin (5.08µm); Features: -; Color: Black; Packaging: Bulk; ComponentLink1URL: http://www.samtec.com/ftppub/cpdf/TX-MKT1.PDF; ComponentLink1Description: http://www.samtec.com/ftppub/cpdf/TX-MKT1.PDF; Molding Height Above Board: 0.100" (2.54mm); ComponentLink2URL: http://www.samtec.com/ftppub/pdf/TD.PDF; ComponentLink2Description: http://www.samtec.com/ftppub/pdf/TD.PDF; Pricing: 1=0.201
J6 = J_MOLX-52271-0679: CONN FFC 6POS 1MM R/A ZIF SMD; Flat Flex Type: FPC; Connector/Contact Type: Contacts, Bottom; Pitch: 0.039" (1.00mm); FFC, FCB Thickness: 0.30mm; Locking Feature: Slide Lock; Cable End Type: Tapered; Actuator Material: Polyphenylene Sulfide (PPS); Voltage Rating: 50V; Material Flammability Rating: UL94 V-0; Supplier 1: Digi-Key; Supplier Part Number 1: WM7955CT-ND; RoHS: RoHS Compliant; Category: Connectors, Interconnects; Stock 1: 8200; Pricing: 1=1.39, 10=1.219, 25=1.1472, 50=1.0992, 100=1.0515, 250=0.95592, 500=0.86032 (USD); Packaging: Cut Tape (CT); Mounting Type: Surface Mount, Right Angle; Termination: Solder; Height Above Board: 0.118" (3.00mm); Contact Material: Phosphor Bronze; Contact Finish: Tin Bismuth; Housing Material: Polyamide (PA46), Nylon 4/6; Features: Solder Retention, Zero Insertion Force (ZIF); Operating Temperature: -40°C ~ 85°C; ComponentLink1URL: http://www.molex.com/pdm_docs/sd/522710479_sd.pdf; ComponentLink1Description: http://www.molex.com/pdm_docs/sd/522710479_sd.pdf
R7 R8 R12 = R_0402_2.2K: RES 2.20K OHM 1/10W 1% 0402 SMD; Manufacturer: Yageo; Manufacturer Part Number: RC0402FR-072K2L; Temperature Coefficient: ±100ppm/°C; Supplier 1: Digi-Key; Supplier Part Number 1: 311-2.20KLRCT-ND; RoHS: RoHS Compliant; Category: Resistors; Stock 1: 0; Pricing: 10=0.014, 100=0.0063, 500=0.00382, 1000=0.0027, 5000=0.00203 (USD); Resistance (Ohms): 2.2K; Composition: Thick Film; Features: -; Package / Case: 0402 (1005 Metric); Size / Dimension: 0.039" L x 0.020" W (1.00mm x 0.50mm); Height: 0.016" (0.40mm); Number of Terminations: 2; Packaging: Cut Tape (CT); ComponentLink1URL: http://www.yageo.com/documents/recent/PYu-RC0402_51_RoHS_L_6.pdf; ComponentLink1Description: http://www.yageo.com/documents/recent/PYu-RC0402_51_RoHS_L_6.pdf; Supplier 2: Digi-Key; Supplier Part Number 2: RMCF0402FT2K20CT-ND; Stock 2: 39712; ComponentLink2URL: http://www.seielect.com/Catalog/SEI-RMCF_RMCP.pdf; ComponentLink2Description: http://www.seielect.com/Catalog/SEI-RMCF_RMCP.pdf
R9-R11 = R_0402_10.0K: RES 10.0K OHM 1/16W 1% 0402 SMD; Manufacturer: Stackpole Electronics Inc; Manufacturer Part Number: RMCF0402FT10K0; Resistance (Ohms): 10k; Temperature Coefficient: ±100ppm/°C; Supplier 1: Digi-Key; Supplier Part Number 1: RMCF0402FT10K0CT-ND; RoHS: RoHS Compliant; Category: Resistors; Stock 1: 234525; Pricing: 1=0.04, 10=0.025, 50=0.0138, 100=0.0105, 250=0.0078, 500=0.00576, 1000=0.00384, 2500=0.00324, 5000=0.0027 (USD); Composition: Thick Film; Features: -; Package / Case: 0402 (1005 Metric); Size / Dimension: 0.039" L x 0.020" W (1.00mm x 0.50mm); Height: 0.016" (0.40mm); Number of Terminations: 2; Packaging: Cut Tape (CT); ComponentLink1URL: http://www.seielect.com/Catalog/SEI-RMCF_RMCP.pdf; ComponentLink1Description: http://www.seielect.com/Catalog/SEI-RMCF_RMCP.pdf
T1 = T_0603_JUMPER_PAD: SOLDER_JUMPER PAD
U4 = U_TI-ADS1015_1115-10: IC ADC 12BIT I2C W/REF 10-MSOP; Number of Inputs: 2, 4; Input Type: Differential, Single Ended; Configuration: MUX-PGA-ADC; Ratio - S/H:ADC: 1:1; Number of A/D Converters: 1; Architecture: Sigma-Delta; Reference Type: Internal; Voltage - Supply, Analog: 2 V ~ 5.5 V; Supplier 1: Digi-Key; RoHS: RoHS Compliant; Category: Integrated Circuits (ICs); Stock 1: 1516; Pricing 1: 1=3.42, 10=3.065, 25=2.756, 100=2.5067 (USD); Packaging: Cut Tape (CT); Voltage - Supply, Digital: 2 V ~ 5.5 V; Features: PGA; Operating Temperature: -40°C ~ 125°C; Package / Case: 10-TFSOP, 10-MSOP (0.118", 3.00mm Width); ComponentLink1URL: http://www.ti.com/lit/ds/symlink/ads1013.pdf; ComponentLink1Description: http://www.ti.com/lit/ds/symlink/ads1013.pdf; Supplier Part Number 1: 296-25227-1-ND

## Sheet Power.SchDoc: TFT PMOD
size Tabloid; Date: 7/9/2017; DrawnBy: Dave McCoy; Engineer: Dave McCoy; DocumentNumber: 4; Revision: B; SheetNumber: 4; SheetTotal: 4
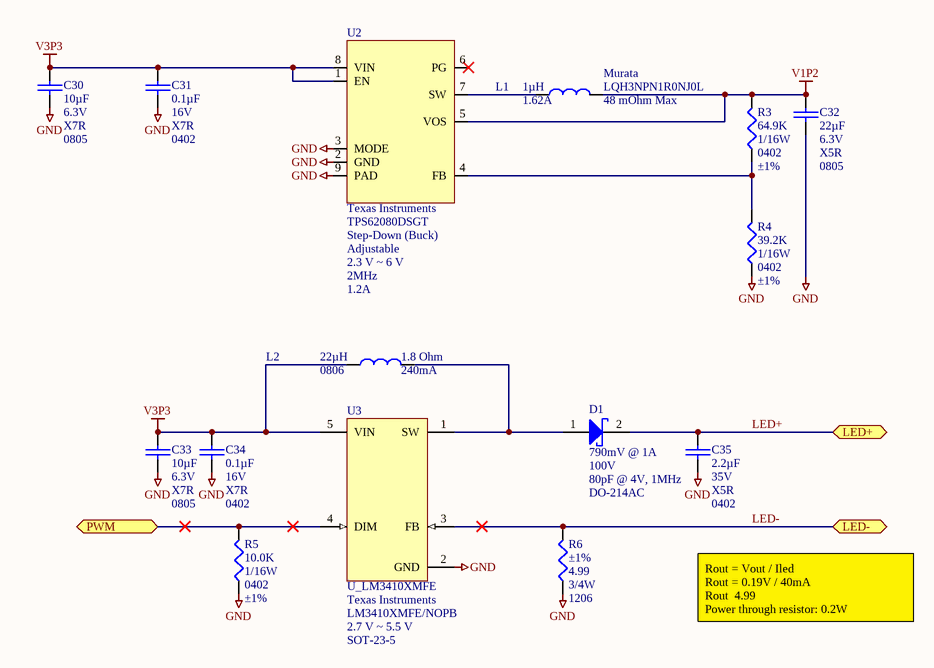
[diagram p3: Power.SchDoc]

### Parts
C30  Capacitance: 10µF  Voltage - Rated: 6.3V  Temperature Coefficient: X7R  Package / Case: 0805  [C_ERA-0805]  (hidden comment: 10uF)
C31  Capacitance: 0.1µF  Voltage - Rated: 16V  Temperature Coefficient: X7R  Package / Case: 0402  [C_0402]  (hidden comment: 0.1uF)
C32  Capacitance: 22µF  Voltage - Rated: 6.3V  Temperature Coefficient: X5R  Package / Case: 0805  [C_ERA-0805]  (hidden comment: 22uF)
C33  Capacitance: 10µF  Voltage - Rated: 6.3V  Temperature Coefficient: X7R  Package / Case: 0805  [C_ERA-0805]  (hidden comment: 10uF)
C34  Capacitance: 0.1µF  Voltage - Rated: 16V  Temperature Coefficient: X7R  Package / Case: 0402  [C_0402]  (hidden comment: 0.1uF)
C35  Capacitance: 2.2µF  Voltage - Rated: 35V  Temperature Coefficient: X5R  Package / Case: 0402  [C_ERA-0402]  (hidden comment: C_0402_2.2uF_35V)
D1  Voltage - Forward (Vf) (Max) @ If: 790mV @ 1A  Voltage - DC Reverse (Vr) (Max): 100V  Capacitance @ Vr, F: 80pF @ 4V, 1MHz  Package / Case: DO-214AC  [DIOM5226X23L]  (hidden comment: B1100-13-F)
L1  Manufacturer Part Number: LQH3NPN1R0NJ0L  Inductance: 1µH  Current: 1.62A  DC Resistance (DCR): 48 mOhm Max  Manufacturer: Murata  [INDNRH1212]  (hidden comment: 1.0uH)
L2  Current: 240mA  Package / Case: 0806  Inductance: 22µH  DC Resistance (DCR): 1.8 Ohm  [L_0806]  (hidden comment: CBC2016T220K)
R3  Resistance In Ohms: 64.9K  Power (Watts): 1/16W  Case: 0402  Tolerance: ±1%  [ERA-0402]  (hidden comment: R_0402_64.9K)
R4  Resistance In Ohms: 39.2K  Power (Watts): 1/16W  Case: 0402  Tolerance: ±1%  [ERA-0402]  (hidden comment: R_0402_39.2K)
R5  Resistance In Ohms: 10.0K  Power (Watts): 1/16W  Case: 0402  Tolerance: ±1%  [R_0402]  (hidden comment: R_0402_10.0K)
R6  Tolerance: ±1%  Resistance In Ohms: 4.99  Power (Watts): 3/4W  Case: 1206  [R_1206]  (hidden comment: R_1206_4.99)
U2  Manufacturer: Texas Instruments  Manufacturer Part Number: TPS62080DSGT  Type: Step-Down (Buck)  Output Type: Adjustable  Voltage - Input: 2.3 V ~ 6 V  Frequency - Switching: 2MHz  Current - Output: 1.2A  [QFN50P200X200X80-8L]  (hidden comment: TPS62080)
U3  U_LM3410XMFE  Manufacturer: Texas Instruments  Manufacturer Part Number: LM3410XMFE/NOPB  Voltage - Supply: 2.7 V ~ 5.5 V  Supplier Device Package: SOT-23-5  [MF05A_N]

### Ports
LED+, LED-, PWM

### Nets
GND: C30.1 C31.1 C32.1 C33.1 C34.1 C35.1 R4.2 R5.2 R6.2 U2.2(GND) U2.3(MODE) U2.9(PAD) U3.2(GND)
V1P2: C32.2 L1.2 R3.1 U2.5(VOS)
V3P3: C30.2 C31.2 C33.2 C34.2 L2.1 U2.1(EN) U2.8(VIN) U3.5(VIN)
LED+: C35.2 D1.2(K) ; port LED+
LED-: R6.1 U3.3(FB) ; port LED-
PWM: R5.1 U3.4(DIM) ; port PWM
NetD1_1: D1.1(A) L2.2 U3.1(SW)
NetL1_1: L1.1 U2.7(SW)
NetR3_2: R3.2 R4.1 U2.4(FB)

Not connected (* = marked no-connect by the designer): U2 6(PG)*

### Notes on the sheet
- Rout = Vout / Iled
  Rout = 0.19V / 40mA
  Rout  4.99
  Power through resistor: 0.2W
- Title:
- http://www.cospandesign.com
- Cospan Design
- Project:
- Document:
- Engineer:
- Drawn By:
- Approved By:
- Revision:
- Date:
- Number:
- of

### Library data of the parts
C30 C33 = C_0805_10UF_6.3V: as C1 on sheet Block Diagram; Supplier 1: Digi-Key; Supplier Part Number 1: 587-1304-1-ND; RoHS: RoHS Compliant; Category: Capacitors; Stock 1: 94004; Tolerance: ±10%; Mounting Type: Surface Mount, MLCC; Operating Temperature: -55°C ~ 85°C; Applications: General Purpose; Ratings: -; Size / Dimension: 0.079" L x 0.049" W (2.00mm x 1.25mm); Lead Spacing: -; Features: -; Packaging: Cut Tape (CT); Lead Style: -; ComponentLink1URL: http://www.yuden.co.jp/productdata/catalog/en/mlcc01_e.pdf; ComponentLink1Description: http://www.yuden.co.jp/productdata/catalog/en/mlcc01_e.pdf; Pricing 1: 1=0.19, 10=0.132, 50=0.08, 100=0.0672, 250=0.0544, 500=0.048, 1000=0.0408 (USD); Height - Seated (Max): -; Thickness (Max): 0.037" (0.95mm)
C31 C34 = C_0402_0.1UF_16V: as C20 on sheet LCD Controller; Supplier 1: Digi-Key; Supplier Part Number 1: 445-4952-1-ND; RoHS: RoHS Compliant; Category: Capacitors; Stock 1: 2696686; Mounting Type: Surface Mount, MLCC; Features: Low ESL; Lead Spacing: -; Packaging: Cut Tape (CT); ComponentLink1URL: https://product.tdk.com/info/en/catalog/datasheets/mlcc_commercial_general_en.pdf; ComponentLink1Description: https://product.tdk.com/info/en/catalog/datasheets/mlcc_commercial_general_en.pdf; Operating Temperature: -55°C ~ 125°C; Pricing 1: 1=0.1, 10=0.05, 100=0.0231, 250=0.01892, 500=0.01618, 1000=0.0126, 5000=0.0105 (USD); Part Status: Not For New Designs; Ratings: -; Applications: General Purpose; Failure Rate: -; Size / Dimension: 0.039" L x 0.020" W (1.00mm x 0.50mm); Height - Seated (Max): -; Thickness (Max): 0.022" (0.55mm); Lead Style: -
C32 = C_0805_22UF_6.3V: CAP CER 22UF 6.3V X7R 10% 0805; Manufacturer: Samsung Electro-Mechanics America, Inc; Manufacturer Part Number: CL21A226MQQNNNE; Tolerance: ±20%; Supplier 1: Digi-Key; Supplier Part Number 1: 1276-1100-1-ND; RoHS: RoHS Compliant; Category: Capacitors; Stock 1: 240091; Pricing: 1=0.27, 10=0.182, 25=0.132, 50=0.11, 100=0.0924, 250=0.0748, 500=0.066, 1000=0.0561 (USD); Mounting Type: Surface Mount, MLCC; Operating Temperature: -55°C ~ 85°C; Applications: General Purpose; Ratings: -; Size / Dimension: 0.079" L x 0.049" W (2.00mm x 1.25mm); Lead Spacing: -; Features: -; Packaging: Cut Tape (CT); Lead Style: -; ComponentLink1URL: http://www.samsungsem.com/servlet/FileDownload?type=spec&file=CL21A226MQQNNNE.pdf; ComponentLink1Description: http://www.samsungsem.com/servlet/FileDownload?type=spec&file=CL21A226MQQNNNE.pdf; Height - Seated (Max): -; Thickness (Max): 0.055" (1.40mm)
C35 = C_0402_2.2uF_35V: CAP CER 2.2UF 35V 20% X5R 0402; Manufacturer: TDK Corporation; Manufacturer Part Number: C1005X5R1V225M050BC; Supplier 1: Digi-Key; Supplier Part Number 1: 445-9056-1-ND; RoHS: RoHS Compliant; Category: Capacitors; Stock 1: 23001; Pricing: 1=0.37, 10=0.308, 100=0.154, 250=0.11552, 500=0.10202, 1000=0.09048, 5000=0.07508 (USD); Packaging: Cut Tape (CT); Tolerance: ±20%; Mounting Type: Surface Mount, MLCC; Operating Temperature: -55°C ~ 85°C; Applications: General Purpose; Ratings: -; Size / Dimension: 0.039" L x 0.020" W (1.00mm x 0.50mm); Height - Seated (Max): -; Thickness (Max): 0.022" (0.55mm); Lead Spacing: -; Features: -; Lead Style: -; ComponentLink1URL: http://product.tdk.com/en/catalog/datasheets/mlcc_commercial_general_en.pdf; ComponentLink1Description: http://product.tdk.com/en/catalog/datasheets/mlcc_commercial_general_en.pdf
D1 = D_SCHOTT_B1100-13-F: DIODE SCHOTTKY 100V 1A SMA; Manufacturer: Diodes Inc; Speed: Fast Recovery =< 500ns, > 200mA (Io); Current - Reverse Leakage @ Vr: 500µA @ 100V; Supplier 1: Digi-Key; Supplier Part Number 1: B1100-FDICT-ND; Manufacturer Part Number: B1100-13-F; RoHS: RoHS Compliant; Category: Discrete Semiconductor Products; Stock 1: 109264; Pricing: 1=0.57, 10=0.4, 25=0.3288, 100=0.2627, 250=0.1914, 500=0.15544, 1000=0.11948, 2500=0.1073 (USD); Diode Type: Schottky; Current - Average Rectified (Io): 1A; Reverse Recovery Time (trr): -; Mounting Type: Surface Mount; Supplier Device Package: SMA; Packaging: Cut Tape (CT); ComponentLink1URL: http://www.diodes.com/datasheets/ds30018.pdf; ComponentLink1Description: http://www.diodes.com/datasheets/ds30018.pdf; COST_1: *; COST_100: *; COST_1000: *; MANF1: *; MANF1_PN: *; MANF2: *; MANF2_PN: *; MANF3: *; MANF3_PN: *; VENDOR1: *; VENDOR1_PN: *
L1 = L_1.0UH_1.62A: INDUCTOR POWER 1.0UH 1620MA 1212; Current - Saturation: 1.65A; Type: Ferrite Core; Tolerance: ±30%; Shielding: Shielded; Frequency - Self Resonant: 140MHz; Material - Core: Ferrite; Frequency - Test: 1MHz; Supplier 1: Digi-Key; Supplier Part Number 1: 490-5342-1-ND; RoHS: RoHS Compliant; Category: Inductors, Coils, Chokes; Stock 1: 2940; Pricing: 1=0.43, 10=0.387, 25=0.3436, 50=0.3006, 100=0.2792, 250=0.25772, 500=0.24482 (USD); Current - Temperature Rise: 1.62A; Q @ Freq: -; Applications: Power Supplies; Package / Case: 1212 (3030 Metric); Mounting Type: Surface Mount; Packaging: Cut Tape (CT); Operating Temperature: -40°C ~ 85°C; ComponentLink1URL: http://search.murata.co.jp/Ceramy/image/img/PDF/ENG/L0075S0103LQH3NP_J0.pdf; ComponentLink1Description: http://search.murata.co.jp/Ceramy/image/img/PDF/ENG/L0075S0103LQH3NP_J0.pdf
L2 = L_0806_22uH: INDUCTOR 22UH 10% 0806 SMD; Manufacturer: Taiyo Yuden; Type: Wirewound; Current - Saturation: 250mA; Shielding: Unshielded; Frequency - Self Resonant: 16MHz; Frequency - Test: 2.52MHz; Supplier 1: Digi-Key; Supplier Part Number 1: 587-3048-1-ND; Manufacturer Part Number: CBC2016T220K; RoHS: RoHS Compliant; Category: Inductors, Coils, Chokes; Stock 1: 3275; Pricing: 1=0.2, 10=0.192, 50=0.18, 100=0.168, 500=0.132, 1000=0.108 (USD); Packaging: Cut Tape (CT); Material - Core: -; Tolerance: ±10%; Current Rating: 240mA; Q @ Freq: -; Operating Temperature: -40°C ~ 105°C; Mounting Type: Surface Mount; Size / Dimension: 0.079" L x 0.063"W (2.00mm x 1.60mm); Height - Seated (Max): 0.071" (1.80mm); Supplier Device Package: 0806 (2016 Metric); ComponentLink1URL: http://www.yuden.co.jp/ut/product/category/inductor/CBC2016T220K.pdf; ComponentLink1Description: http://www.yuden.co.jp/ut/product/category/inductor/CBC2016T220K.pdf
R3 = R_0402_64.9K: RES 64.9K OHM 1/16W 1% 0402 SMD; Manufacturer: Yageo; Manufacturer Part Number: RC0402FR-0764K9L; Temperature Coefficient: ±100ppm/°C; Supplier 1: Digi-Key; Supplier Part Number 1: 311-64.9KLRCT-ND; RoHS: RoHS Compliant; Category: Resistors; Stock 1: 52870; Pricing: 10=0.014, 50=0.0104, 100=0.0079, 250=0.00584, 500=0.00432, 1000=0.00288 (USD); Resistance (Ohms): 64.9K; Composition: Thick Film; Features: -; Size / Dimension: 0.039" L x 0.020" W (1.00mm x 0.50mm); Height: 0.016" (0.40mm); Number of Terminations: 2; Packaging: Cut Tape (CT); Package / Case: 0402 (1005 Metric); ComponentLink1URL: http://www.yageo.com/documents/recent/PYu-RC0402_51_RoHS_L_6.pdf; ComponentLink1Description: http://www.yageo.com/documents/recent/PYu-RC0402_51_RoHS_L_6.pdf
R4 = R_0402_39.2K: RES 39.2K OHM 1/16W 1% 0402 SMD; Manufacturer: Yageo; Manufacturer Part Number: RC0402FR-0739K2L; Temperature Coefficient: ±100ppm/°C; Supplier 1: Digi-Key; RoHS: RoHS Compliant; Category: Resistors; Stock 1: 76395; Pricing 1: 10=0.014, 100=0.0063, 500=0.00382, 1000=0.0027, 5000=0.00203 (USD); Resistance (Ohms): 39.2K; Composition: Thick Film; Features: -; Package / Case: 0402 (1005 Metric); Size / Dimension: 0.039" L x 0.020" W (1.00mm x 0.50mm); Height: 0.016" (0.40mm); Number of Terminations: 2; Packaging: Cut Tape (CT); ComponentLink1URL: http://www.yageo.com/documents/recent/PYu-RC0402_51_RoHS_L_6.pdf; ComponentLink1Description: http://www.yageo.com/documents/recent/PYu-RC0402_51_RoHS_L_6.pdf; Supplier Part Number 1: 311-39.2KLRCT-ND
R5 = R_0402_10.0K: as R9 on sheet LCD Connector; Supplier 1: Digi-Key; Supplier Part Number 1: RMCF0402FT10K0CT-ND; RoHS: RoHS Compliant; Category: Resistors; Stock 1: 234525; Pricing: 1=0.04, 10=0.025, 50=0.0138, 100=0.0105, 250=0.0078, 500=0.00576, 1000=0.00384, 2500=0.00324, 5000=0.0027 (USD); Composition: Thick Film; Features: -; Package / Case: 0402 (1005 Metric); Size / Dimension: 0.039" L x 0.020" W (1.00mm x 0.50mm); Height: 0.016" (0.40mm); Number of Terminations: 2; Packaging: Cut Tape (CT); ComponentLink1URL: http://www.seielect.com/Catalog/SEI-RMCF_RMCP.pdf; ComponentLink1Description: http://www.seielect.com/Catalog/SEI-RMCF_RMCP.pdf
R6 = R_1206_4.99: RES SMD 4.99 OHM 1% 3/4W 1206; Manufacturer: Vishay / Dale; Manufacturer Part Number: CRCW12064R99FKEAHP; Max Power Dissipation: 500mW; Temperature Coefficient: 100ppm/°C; Resistance: 4.99R; Supplier 1: Digikey; Stock 1: 24650; Pricing 1: 1=0.49, 10=0.375, 100=0.1577, 1000=0.087, 2500=0.0816 (USD); Case/Package: 1206; Case Code (Metric): 3216; Case Code (Imperial): 1206; Contact Plating: Tin; Min Operating Temperature: -55°C; Max Operating Temperature: 155°C; Packaging: Tape and Reel; Composition: Thick Film; Number of Terminations: 2; Length: 0.122inch; Height: 0.026inch; Width: 0.063inch; Lead Free: Lead Free; ComponentLink1URL: http://www.vishay.com/docs/20043/crcwhpe3.pdf; ComponentLink1Description: http://www.vishay.com/docs/20043/crcwhpe3.pdf; Supplier Part Number 1: 541-4.99UDKR-ND
U2 = U_TPS62080: IC BUCK SYNC ADJ 1.2A 8WSON; Number of Outputs: 1; Voltage - Output: 0.5 V ~ 4 V; PWM Type: Hybrid; Synchronous Rectifier: Yes; Supplier 1: Digi-Key; Supplier Part Number 1: 296-29645-1-ND; RoHS: RoHS Compliant; Category: Integrated Circuits (ICs); Stock 1: 288; Pricing: 1=4.03, 10=3.612, 25=3.248, 100=2.954 (USD); Operating Temperature: -40°C ~ 85°C; Mounting Type: Surface Mount; Package / Case: 8-WFDFN Exposed Pad; Packaging: Cut Tape (CT); Supplier Device Package: 8-WSON Exposed Pad (2x2); ComponentLink1URL: http://www.ti.com/lit/ds/symlink/tps62080.pdf; ComponentLink1Description: http://www.ti.com/lit/ds/symlink/tps62080.pdf
U3 = U_LM3410XMFE: IC DRVR WT/OLED BCKLT SOT23-5; Constant Current: Yes; Topology: PWM, SEPIC, Step-Up (Boost); Number of Outputs: 1; Type - Primary: Automotive, Backlight, Flash/Torch; Type - Secondary: High Brightness LED (HBLED), OLED, White LED; Frequency: 1.2MHz ~ 2MHz; Voltage - Output: 3 V ~ 24 V; Supplier 1: Digi-Key; Supplier Part Number 1: LM3410XMFE/NOPBCT-ND; RoHS: RoHS Compliant; Category: Integrated Circuits (ICs); Stock 1: 405; Pricing: 1=2.98, 10=2.67, 25=2.4012, 100=2.1839 (USD); Packaging: Cut Tape (CT); Constant Voltage: -; Internal Driver: Yes; Mounting Type: Surface Mount; Package / Case: SC-74A, SOT-753; Operating Temperature: -40°C ~ 125°C; ComponentLink1URL: http://www.ti.com/lit/ds/symlink/lm3410.pdf; ComponentLink1Description: http://www.ti.com/lit/ds/symlink/lm3410.pdf

## Nets that join several sheets
GND: Block Diagram (8 pins), LCD Controller (50 pins), LCD Connector (12 pins), Power (13 pins)
V1P2: LCD Controller (31 pins), Power (C32.2 L1.2 R3.1 U2.5)
V3P3: Block Diagram (8 pins), LCD Controller (28 pins), LCD Connector (11 pins), Power (8 pins)
CS_N: Block Diagram (J1.7), LCD Controller (U1.123)
D0: Block Diagram (J2.1), LCD Controller (U1.7)
D1: Block Diagram (J2.2), LCD Controller (U1.8)
D2: Block Diagram (J2.3), LCD Controller (U1.9)
D3: Block Diagram (J2.4), LCD Controller (U1.10)
D4: Block Diagram (J2.7), LCD Controller (U1.11)
D5: Block Diagram (J2.8), LCD Controller (U1.116)
D6: Block Diagram (J2.9), LCD Controller (U1.115)
D7: Block Diagram (J2.10), LCD Controller (U1.114)
DC: Block Diagram (J1.8), LCD Controller (U1.122)
GPIO0: LCD Controller (U1.36), LCD Connector (J3.31)
LDATA0: LCD Controller (U1.81), LCD Connector (J3.21)
LDATA1: LCD Controller (U1.80), LCD Connector (J3.22)
LDATA2: LCD Controller (U1.79), LCD Connector (J3.23)
LDATA3: LCD Controller (U1.78), LCD Connector (J3.24)
LDATA4: LCD Controller (U1.77), LCD Connector (J3.25)
LDATA5: LCD Controller (U1.76), LCD Connector (J3.26)
LDATA6: LCD Controller (U1.72), LCD Connector (J3.27)
LDATA7: LCD Controller (U1.71), LCD Connector (J3.28)
LDATA8: LCD Controller (U1.70), LCD Connector (J3.13)
LDATA9: LCD Controller (U1.69), LCD Connector (J3.14)
LDATA10: LCD Controller (U1.68), LCD Connector (J3.15)
LDATA11: LCD Controller (U1.67), LCD Connector (J3.16)
LDATA12: LCD Controller (U1.63), LCD Connector (J3.17)
LDATA13: LCD Controller (U1.62), LCD Connector (J3.18)
LDATA14: LCD Controller (U1.61), LCD Connector (J3.19)
LDATA15: LCD Controller (U1.60), LCD Connector (J3.20)
LDATA16: LCD Controller (U1.59), LCD Connector (J3.5)
LDATA17: LCD Controller (U1.35), LCD Connector (J3.6)
LDATA18: LCD Controller (U1.86), LCD Connector (J3.7)
LDATA19: LCD Controller (U1.85), LCD Connector (J3.8)
LDATA20: LCD Controller (U1.31), LCD Connector (J3.9)
LDATA21: LCD Controller (U1.30), LCD Connector (J3.10)
LDATA22: LCD Controller (U1.29), LCD Connector (J3.11)
LDATA23: LCD Controller (U1.28), LCD Connector (J3.12)
LDEN: LCD Controller (U1.49), LCD Connector (J3.34)
LED+: LCD Connector (J3.1), Power (C35.2 D1.2)
LED-: LCD Connector (J3.2), Power (R6.1 U3.3)
LFRAME: LCD Controller (U1.43), LCD Connector (J3.33)
LLINE: LCD Controller (U1.44), LCD Connector (J3.32)
LSHIFT: LCD Controller (U1.45), LCD Connector (J3.30)
PWM: LCD Controller (U1.51), Power (R5.1 U3.4)
RD_N: Block Diagram (J1.3), LCD Controller (U1.121)
RESET_N: Block Diagram (J1.9), LCD Controller (U1.127)
SCL: Block Diagram (J1.1), LCD Connector (J5.1 J6.3 R7.2 U4.10)
SDA: Block Diagram (J1.2), LCD Connector (J5.2 J6.4 R8.2 U4.9)
TE: Block Diagram (J1.10), LCD Controller (U1.50)
WR_N: Block Diagram (J1.4), LCD Controller (U1.120)

## Assembly variants
Production: not fitted C36 J4 J5 J6 R7 R8 R9 R10 R11 R12 U4